# Altium schematic sheet bottom_simp_motor.SchDoc
size A
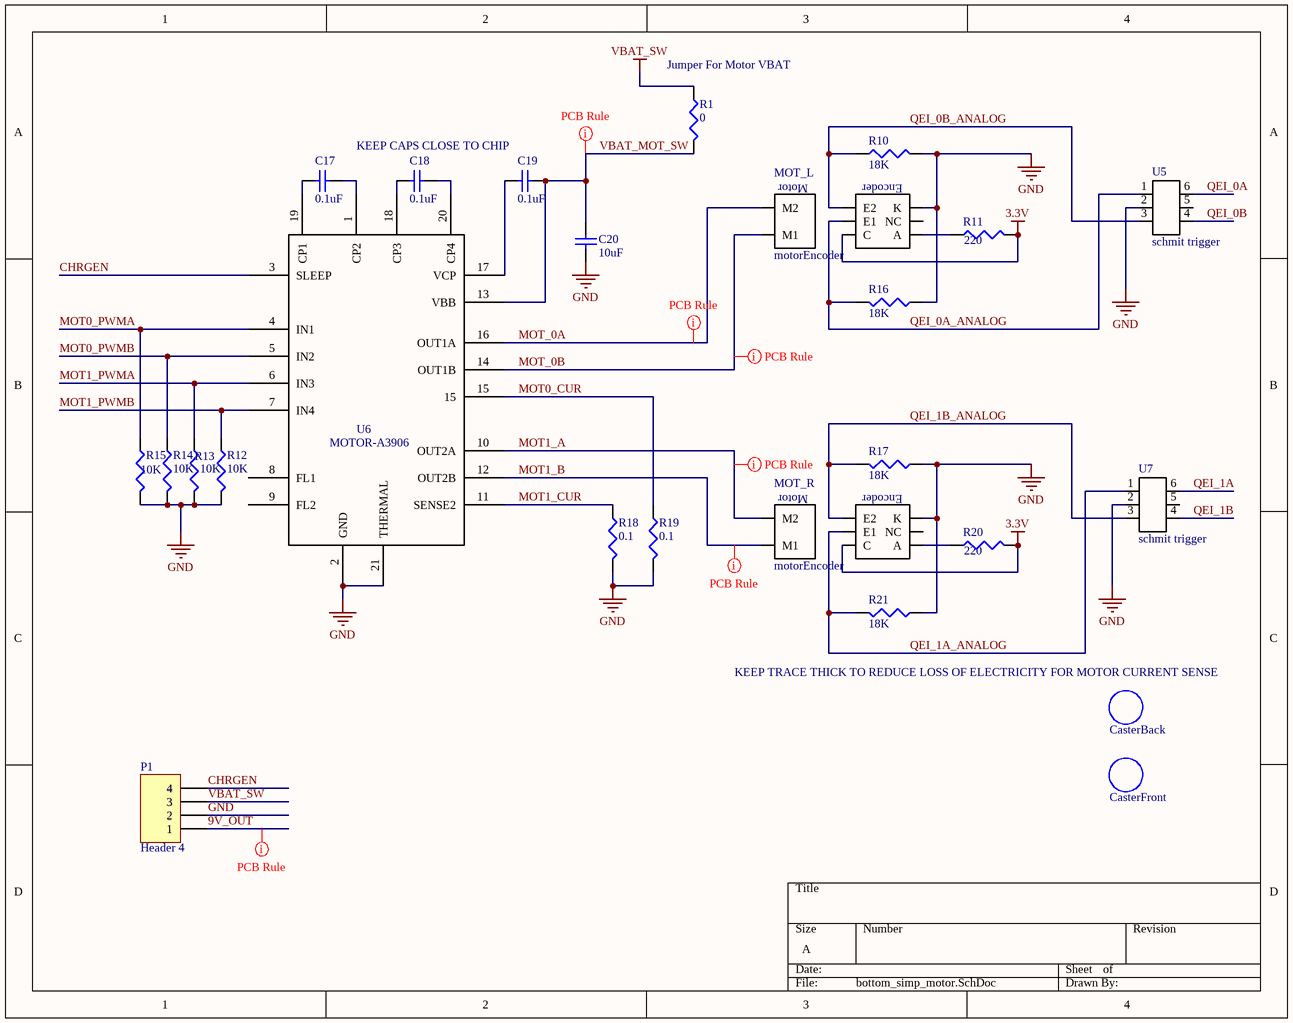
[diagram p0: bottom_simp_motor.SchDoc]

## Parts
C17  value 0.1uF  [CAPC1005L]  (hidden comment: Cap Semi)
C18  value 0.1uF  [CAPC1005L]  (hidden comment: Cap Semi)
C19  value 0.1uF  [CAPC1005L]  (hidden comment: Cap Semi)
C20  value 10uF  [CAPC1608L]  (hidden comment: Cap Semi)
CasterBack  non connect  [3/8"Caster]  (value not drawn)
CasterFront  non connect  [3/8"Caster]  (value not drawn)
MOT_L  motorEncoder  [motorEncoder]
MOT_R  motorEncoder  [motorEncoder]
P1  Header 4  [HDR1X4]
R1  value 0  [RESC3225L]  (hidden comment: Res3)
R10  value 18K  [RESC1608L]
R11  value 220  [RESC1608L]
R12  value 10K  [RESC1608L]  (hidden comment: Res3)
R13  value 10K  [RESC1608L]  (hidden comment: Res3)
R14  value 10K  [RESC1608L]  (hidden comment: Res3)
R15  value 10K  [RESC1608L]  (hidden comment: Res3)
R16  value 18K  [RESC1608L]
R17  value 18K  [RESC1608L]
R18  value 0.1  [RESC1608L]  (hidden comment: Res3)
R19  value 0.1  [RESC1608L]  (hidden comment: Res3)
R20  value 220  [RESC1608L]
R21  value 18K  [RESC1608L]
U5  schmit trigger  [DCK(R-PDSO-C6)]
U6  MOTOR-A3906  [QFN-20]
U7  schmit trigger  [DCK(R-PDSO-C6)]

## Nets
3.3V: MOT_L.C MOT_R.C R11.2 R20.2
GND: C20.1 MOT_L.K MOT_R.K P1.2 R10.2 R12.2 R13.2 R14.2 R15.2 R16.1 R17.1 R18.2 R19.2 R21.1 U5.2 U6.2(GND) U6.21(THERMAL) U7.2
VBAT_SW: P1.3 R1.1
9V_OUT: P1.1
CHRGEN: P1.4 U6.3(SLEEP)
MOT0_CUR: R19.1 U6.15
MOT0_PWMA: R15.1 U6.4(IN1)
MOT0_PWMB: R14.1 U6.5(IN2)
MOT1_A: MOT_R.M2 U6.10(OUT2A)
MOT1_B: MOT_R.M1 U6.12(OUT2B)
MOT1_CUR: R18.1 U6.11(SENSE2)
MOT1_PWMA: R13.1 U6.6(IN3)
MOT1_PWMB: R12.1 U6.7(IN4)
MOT_0A: MOT_L.M2 U6.16(OUT1A)
MOT_0B: MOT_L.M1 U6.14(OUT1B)
QEI_0A: U5.6
QEI_0A_ANALOG: MOT_L.E1 R16.2 U5.1
QEI_0B: U5.4
QEI_0B_ANALOG: MOT_L.E2 R10.1 U5.3
QEI_1A: U7.6
QEI_1A_ANALOG: MOT_R.E1 R21.2 U7.1
QEI_1B: U7.4
QEI_1B_ANALOG: MOT_R.E2 R17.2 U7.3
VBAT_MOT_SW: C19.1 C20.2 R1.2 U6.13(VBB)
NetC17_1: C17.1 U6.19(CP1)
NetC17_2: C17.2 U6.1(CP2)
NetC18_1: C18.1 U6.18(CP3)
NetC18_2: C18.2 U6.20(CP4)
NetC19_2: C19.2 U6.17(VCP)
NetMOT_L_A: MOT_L.A R11.1
NetMOT_R_A: MOT_R.A R20.1

Not connected (* = marked no-connect by the designer): MOT_L NC; MOT_R NC; U5 5; U6 8(FL1) 9(FL2); U7 5

## Layout directives
rule Width Constraint [Pref Width = 20mil    Min Width = 10mil    Max Width = 25mil]: 9V_OUT, MOT1_A, MOT1_B, MOT_0A, MOT_0B, VBAT_MOT_SW

## Notes on the sheet
- (near R1) Jumper For Motor VBAT
- KEEP CAPS CLOSE TO CHIP
- (near CasterBack) KEEP TRACE THICK TO REDUCE LOSS OF ELECTRICITY FOR MOTOR CURRENT SENSE
- (in symbol motorEncoder) Motor; Encoder

## Library data of the parts
C17-C20 = Cap Semi: Capacitor (Semiconductor SIM Model); Published: 8-Jun-2000; LatestRevisionDate: 29-May-2009; LatestRevisionNote: IPC-7351 Footprint Added.; PackageReference: C1206; Publisher: Altium Limited; PackageDescription: Chip Capacitor
CasterBack CasterFront = Caster: This is just a space saver to get the caster onto the pcb
P1 = Header 4: Header, 4-Pin; LatestRevisionDate: 17-Jul-2002; LatestRevisionNote: Re-released for DXP Platform.; Publisher: Altium Limited
R1 R10-R21 = Res3: Resistor; Published: 8-Jun-2000; LatestRevisionDate: 29-May-2009; LatestRevisionNote: IPC-7351 Footprint Added.; PackageReference: J1-0603; Publisher: Altium Limited; PackageDescription: Chip Resistor